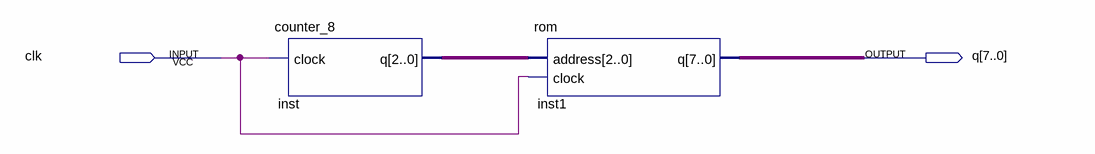
[diagram p0: schematic sheet]
// Quartus schematic test.bdf as structural Verilog: 2 symbols, 2 pins
module test (
  input  clk,
  output [7:0] q
);

  wire [2:0] inst_q;

  counter_8 inst (.clock(clk), .q(inst_q));
  rom inst1 (.address(inst_q), .clock(clk), .q(q));
endmodule
